# EAGLE design oled (EAGLE 7.5.0)
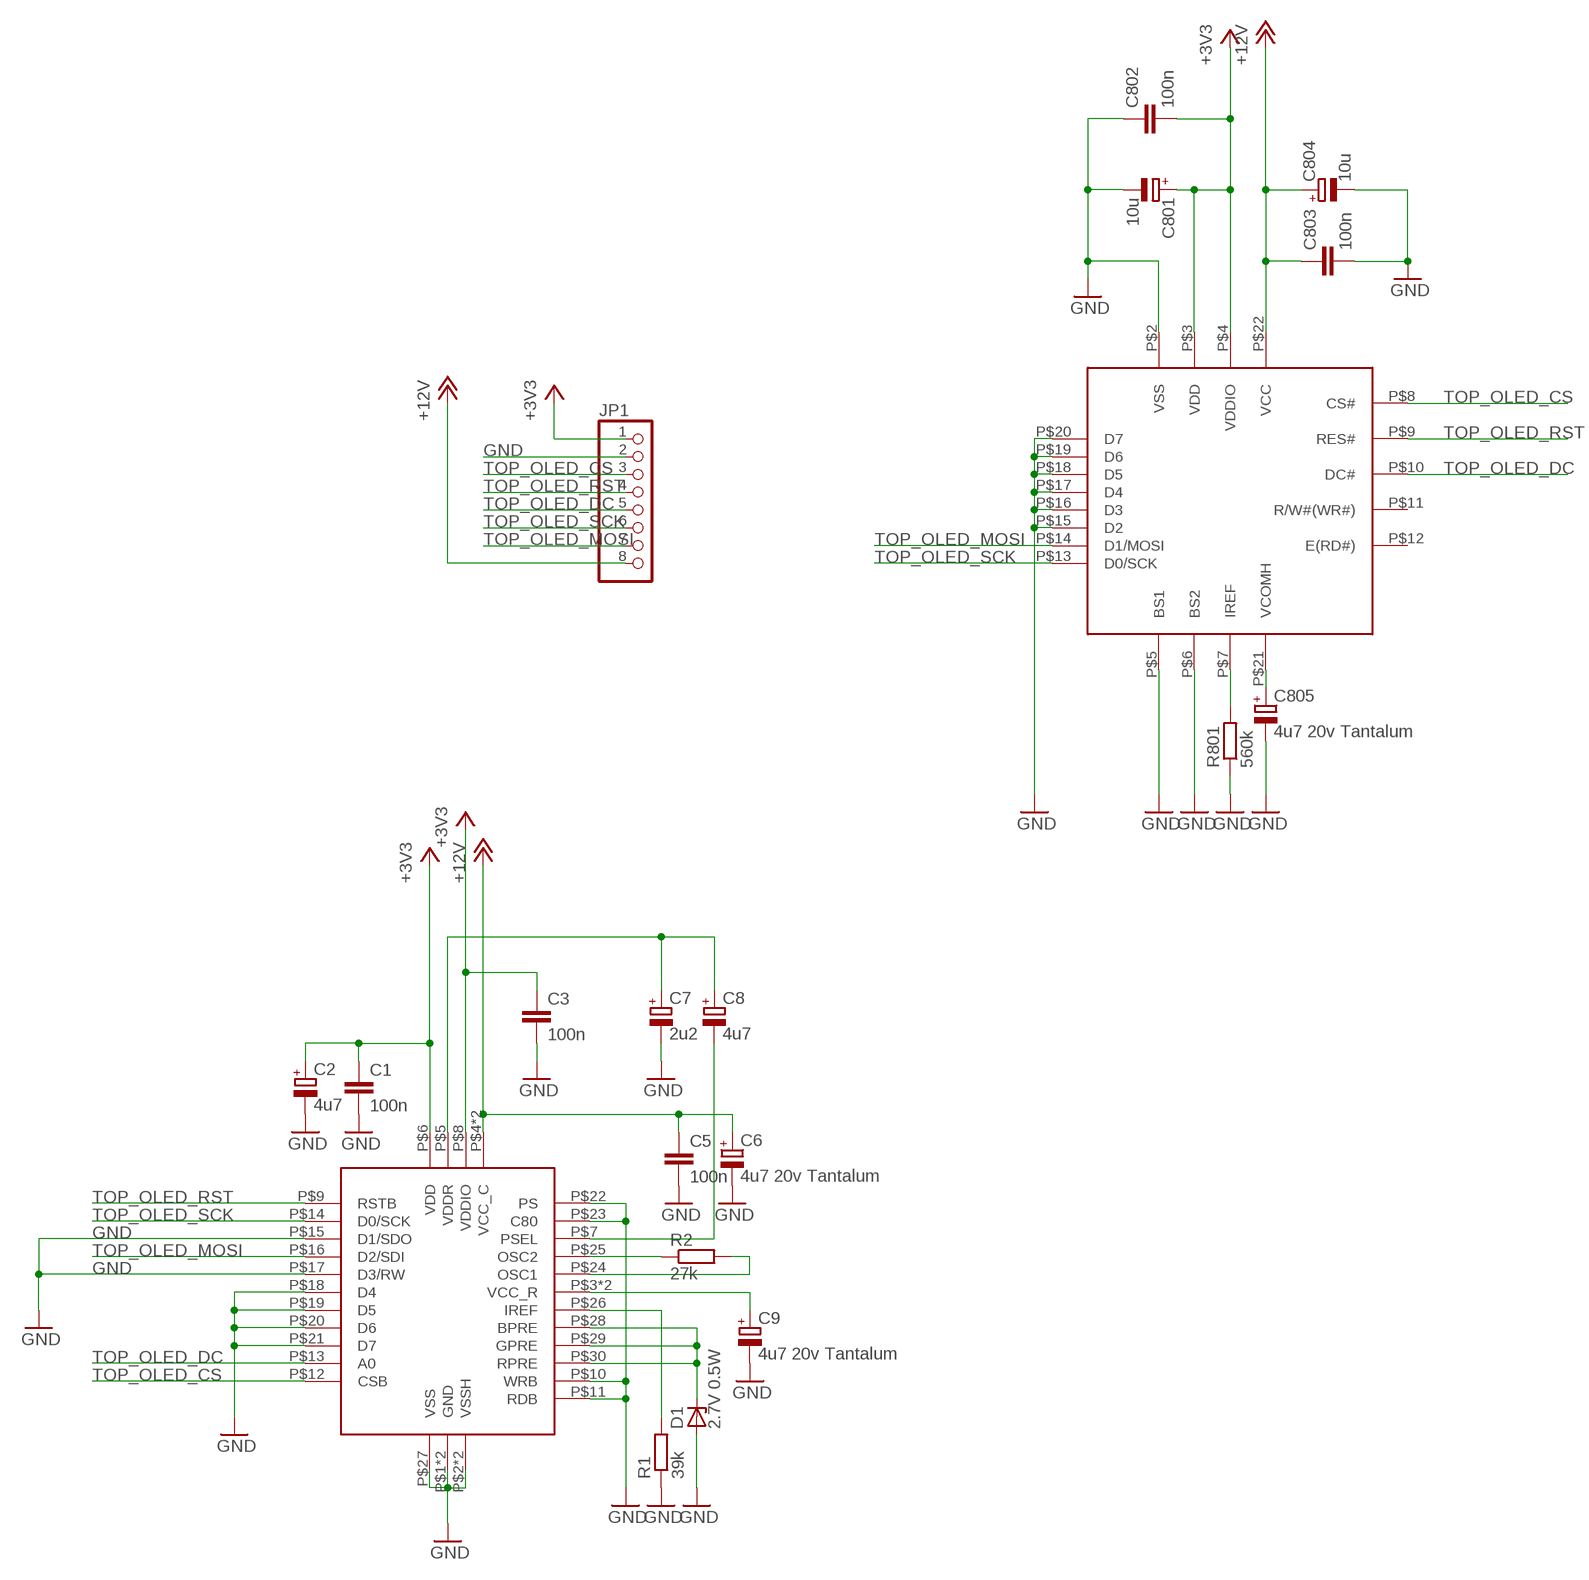
[diagram p0: schematic, sheet 1]

## Parts
C1  100n  C-EUC0603  [C0603]
C2  4u7  CPOL-EU153CLV-0505  [CPOL-5]
C3  100n  C-EUC0603  [C0603]
C5  100n  C-EUC0603  [C0603]
C6  4u7 20v Tantalum  CPOL-EUCT3216  [CT3216]
C7  2u2  CPOL-EU153CLV-0505  [CPOL-5]
C8  4u7  CPOL-EU153CLV-0505  [CPOL-5]
C9  4u7 20v Tantalum  CPOL-EUCT3216  [CT3216]
C801  10u  CPOL-EU153CLV-0505  [CPOL-5]
C802  100n  C-EUC0603  [C0603]
C803  100n  C-EUC0603  [C0603]
C804  10u  CPOL-EU153CLV-0505  [CPOL-5]
C805  4u7 20v Tantalum  CPOL-EUCT3216  [CT3216]
D1  2.7V 0.5W  ZENER-DIODESOD80C  [SOD80C]
JP1  PINHD-1X8  [1X08]
OLED  MCOT096064AZ-RGBM  [MCOT096064AZ-RGBM]
R1  39k  R-EU_0603  [0603]
R2  27k  R-EU_0603  [0603]
R801  560k  R-EU_0603  [0603]
U$1  MCOT096096AY  [MCOT096096AY]

## Nets
+3V3: C1.1 C2.+ C3.1 C801.+ C802.2 JP1.1 OLED.P$3(VDD) OLED.P$4(VDDIO) U$1.P$6(VDD) U$1.P$8(VDDIO)
+12V: C5.1 C6.+ C803.1 C804.+ JP1.8 OLED.P$22(VCC) U$1.P$4(VCC_C) U$1.P$31(VCC_C)
GND: C1.2 C2.- C3.2 C5.2 C6.- C7.- C9.- C801.- C802.1 C803.2 C804.- C805.- D1.A JP1.2 OLED.P$2(VSS) OLED.P$5(BS1) OLED.P$6(BS2) OLED.P$15(D2) OLED.P$16(D3) OLED.P$17(D4) OLED.P$18(D5) OLED.P$19(D6) OLED.P$20(D7) R1.1 R801.1 U$1.P$1(GND) U$1.P$2(VSSH) U$1.P$10(WRB) U$1.P$11(RDB) U$1.P$15(D1/SDO) U$1.P$17(D3/RW) U$1.P$18(D4) U$1.P$19(D5) U$1.P$20(D6) U$1.P$21(D7) U$1.P$22(PS) U$1.P$23(C80) U$1.P$27(VSS) U$1.P$33(VSSH) U$1.P$34(GND)
N$1: C9.+ U$1.P$3(VCC_R) U$1.P$32(VCC_R)
N$5: C7.+ C8.+ U$1.P$5(VDDR)
N$6: C805.+ OLED.P$21(VCOMH)
N$7: C8.- U$1.P$7(PSEL)
N$8: OLED.P$7(IREF) R801.2
N$9: D1.C U$1.P$28(BPRE) U$1.P$29(GPRE) U$1.P$30(RPRE)
N$10: R2.1 U$1.P$25(OSC2)
N$11: R2.2 U$1.P$24(OSC1)
N$12: R1.2 U$1.P$26(IREF)
TOP_OLED_CS: JP1.3 OLED.P$8(CS#) U$1.P$12(CSB)
TOP_OLED_DC: JP1.5 OLED.P$10(DC#) U$1.P$13(A0)
TOP_OLED_MOSI: JP1.7 OLED.P$14(D1/MOSI) U$1.P$16(D2/SDI)
TOP_OLED_RST: JP1.4 OLED.P$9(RES#) U$1.P$9(RSTB)
TOP_OLED_SCK: JP1.6 OLED.P$13(D0/SCK) U$1.P$14(D0/SCK)
Unconnected: OLED.P$11(R/W#(WR#)) OLED.P$12(E(RD#))

## Library data of the parts
C1 C3 C5 C802 C803 = Rebel:C-EU: CAPACITOR, European symbol
C2 C6-C9 C801 C804 C805 = Rebel:CPOL-EU: POLARIZED CAPACITOR, European symbol
D1 = diode:ZENER-DIODE: Z-Diode
JP1 = pinhead:PINHD-1X8: PIN HEADER
OLED = MCOT096064AZ-RGBM:MCOT096064AZ-RGBM: Midas 0.95in Red, Green, Blue Passive matrix OLED Display 96 x 64 TAB Multi Interface
R1 R2 R801 = Rebel:R-EU_: RESISTOR, European symbol
U$1 = Rebel:MCOT096096AY

## Net classes
1 power: width 0.178 mm, drill 0.305 mm, clearance 0.178 mm to class 0, clearance 0.178 mm

## Board
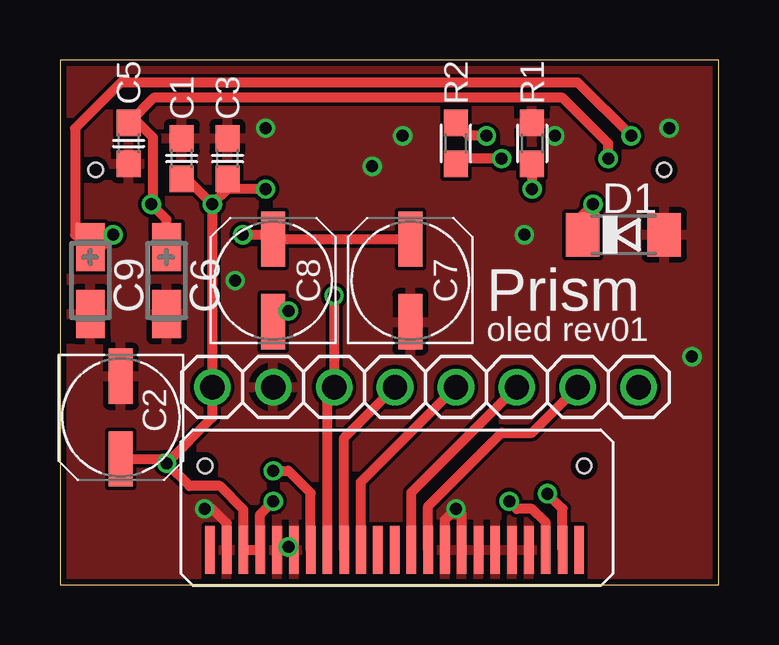
[diagram p1: board, top side]
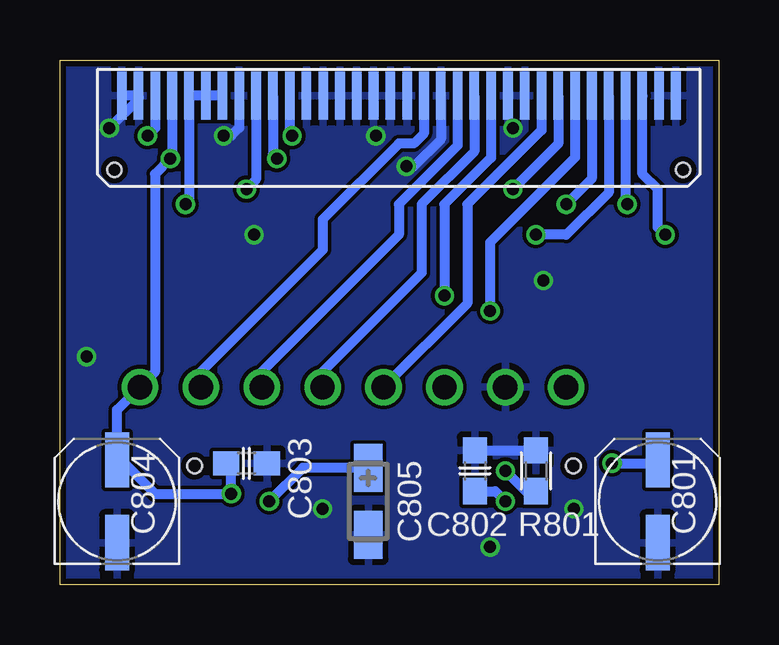
[diagram p2: board, bottom side, seen from below]

Size 27.46 x 21.89 mm. Coordinates in mm from the lower left corner, seen from the top.
Outline: 27.46,21.89 0,21.89 0,0 27.46,0 27.46,21.89
Copper layers (1*16): Top 0.035mm / dielectric 1.5mm / Bottom 0.035mm
Design rules "SeeedStudio_2layer_DRU_no_angle_20140221": minimum track width 6mil, minimum drill 12mil, track to track 6mil, track to pad 6mil, pad to pad 6mil, via to via 6mil, smd to smd 0mil, copper to edge 10mil, drill to drill 10mil, minimum pad ring 10mil, minimum via ring 6mil, stop-mask expansion 2mil, vias tented up to drill 100mil, thermal gap 10mil

### Footprints (pad centres in the part's own frame; a part is rotated, then mirrored left to right if it is on the bottom)
C0603 = smd 1.1 x 1: 1 -0.85,0; 2 0.85,0
CPOL-5 = smd 2.3 x 1: + 1.725,0; - -1.725,0
CT3216 = smd 2 x 1.2: + -1.4,0; - 1.4,0
SOD80C = smd 1.4 x 1.8: A 1.7,0; C -1.7,0
1X08 = drill 1.016: 1 -8.89,0; 2 -6.35,0; 3 -3.81,0; 4 -1.27,0; 5 1.27,0; 6 3.81,0; 7 6.35,0; 8 8.89,0
MCOT096064AZ-RGBM = smd 0.4 x 2: P$1 -7.72,-2.024; P$2 -7.02,-2.024; P$3 -6.32,-2.024; P$4 -5.62,-2.024; P$5 -4.92,-2.024; P$6 -4.22,-2.024; P$7 -3.52,-2.024; P$8 -2.82,-2.024; P$9 -2.12,-2.024; P$10 -1.42,-2.024; P$11 -0.72,-2.024; P$12 -0.02,-2.024; P$13 0.68,-2.024; P$14 1.38,-2.024; P$15 2.08,-2.024; P$16 2.78,-2.024; P$17 3.48,-2.024; P$18 4.18,-2.024; P$19 4.88,-2.024; P$20 5.58,-2.024; P$21 6.28,-2.024; P$22 6.98,-2.024; P$23 7.68,-2.024 | hole 0.6: -7.92,1.476; 7.88,1.476
0603 = smd 1.1 x 1: 1 -0.85,0; 2 0.85,0
MCOT096096AY = smd 0.4 x 2: P$1 -11.55,-2; P$2 -10.85,-2; P$3 -10.15,-2; P$4 -9.45,-2; P$5 -8.75,-2; P$6 -8.05,-2; P$7 -7.35,-2; P$8 -6.65,-2; P$9 -5.95,-2; P$10 -5.25,-2; P$11 -4.55,-2; P$12 -3.85,-2; P$13 -3.15,-2; P$14 -2.45,-2; P$15 -1.75,-2; P$16 -1.05,-2; P$17 -0.35,-2; P$18 0.35,-2; P$19 1.05,-2; P$20 1.75,-2; P$21 2.45,-2; P$22 3.15,-2; P$23 3.85,-2; P$24 4.55,-2; P$25 5.25,-2; P$26 5.95,-2; P$27 6.65,-2; P$28 7.35,-2; P$29 8.05,-2; P$30 8.75,-2; P$31 9.45,-2; P$32 10.15,-2; P$33 10.85,-2; P$34 11.55,-2 | hole 0.6: 11.85,1.1; -11.85,1.1

### Placement (x,y rotation side)
C1  5.08,17.78 90 top
C2  2.54,6.98 270 top
C3  6.99,17.78 90 top
C5  2.86,18.41 270 top
C6  4.45,12.7 270 top
C7  14.61,12.7 90 top
C8  8.89,12.7 90 top
C9  1.27,12.7 270 top
C801  2.54,3.49 90 bottom
C802  10.16,4.76 270 bottom
C803  19.68,5.08 0 bottom
C804  25.08,3.49 90 bottom
C805  14.61,3.49 270 bottom
D1  23.49,14.6 0 top
JP1  15.24,8.25 0 top
OLED  13.97,3.49 0 top
R1  19.68,18.41 270 top
R2  16.51,18.41 90 top
R801  7.62,4.76 270 bottom
U$1  13.34,18.41 180 bottom

### Tracks (layer width: path | path; a pad name or v marks a point on that pad's centre or on a via)
+3V3  (via drill 0.5)
  Top 0.406: v8.89,3.49 8.35,2.95 OLED.P$4 OLED.P$3 7.65,3.14 6.67,4.13 5.4,4.13 v4.45,5.08 | v6.35,15.88 JP1.1 6.35,6.98 v4.45,5.08 | v8.57,16.51 7.2,16.51 | 7.2,16.51 C3.1 | C1.1 5.29,16.93 v6.35,15.88 | 7.2,16.51 6.99,16.51 v6.35,15.88 | C2.+ 4.27,5.26 v4.45,5.08
  Bottom 0.406: C802.2 9.31,3.91 v8.89,3.49 | v4.45,5.08 2.72,5.08 C801.+ | U$1.P$6 5.29,16.94 v6.35,15.88 | U$1.P$8 6.69,18.4 v8.57,16.51
+12V  (via drill 0.5)
  Top 0.406: C6.+ 4.45,15.24 v3.81,15.88 3.88,15.95 3.88,18.66 3.28,19.27 C5.1 3.91,20.32 20.95,20.32 22.86,18.41 v22.86,17.78 | OLED.P$22 20.95,3.18 v20.32,3.81
  Bottom 0.406: U$1.P$4 3.88,15.8 v3.81,15.88 | U$1.P$31 22.79,17.85 v22.86,17.78 23.49,17.14 23.49,8.89 JP1.8 25.08,7.3 C804.+ 24.9,5.22 23.49,3.81 v20.32,3.81 20.32,4.86 C803.1
GND  (via drill 0.5)
  Top 0.406: 9.41,1.47 OLED.P$6 | OLED.P$2 6.95,2.58 6.35,3.17 v6.03,3.17 | OLED.P$5 9.41,1.47 | 9.41,1.47 v9.53,1.59 | OLED.P$15 16.05,2.71 v16.51,3.17 16.75,2.94 OLED.P$16
  Bottom 0.406: C802.1 R801.1 | U$1.P$34 U$1.P$33 24.18,20.27 v25.4,19.05 | U$1.P$27 19.98,19.07 20.32,18.73 v20.64,18.73 | U$1.P$15 11.59,18.58 12.7,17.46 v13.02,17.46
  other vias: 8.57,19.05 7.3,12.7 19.37,14.6 14.29,18.73 26.35,9.52
  pour Top: -5.71,23.49 34.93,23.49 34.93,-2.54 -5.71,-2.54
  pour Bottom: -3.17,22.22 -3.17,-1.27 32.39,-1.27 32.39,22.22
N$1  (via drill 0.5)
  Top 0.406: v2.22,14.6 1.72,14.1 C9.+ 0.64,14.6 0.64,19.05 2.54,20.95 21.59,20.95 v23.81,18.73
  Bottom 0.406: v2.22,14.6 2.54,14.92 2.54,16.51 3.17,17.14 U$1.P$3 | U$1.P$32 23.48,19.06 v23.81,18.73
N$5  (via drill 0.5)
  Top 0.406: v7.62,14.6 8.71,14.6 C8.+ C7.+
  Bottom 0.406: U$1.P$5 4.58,16.37 6.35,14.6 v7.62,14.6
N$6  (via drill 0.5)
  Top 0.406: OLED.P$21 20.25,2.61 19.68,3.17 19.05,3.17 v18.73,3.49
  Bottom 0.406: C805.+ 17.33,4.89 v18.73,3.49
N$7  (via drill 0.5)
  Top 0.406: v9.53,11.43 9.39,11.43 C8.-
  Bottom 0.406: U$1.P$7 5.99,17.83 9.53,14.29 v9.53,11.43
N$8  (via drill 0.5)
  Top 0.406: v8.89,4.76 9.53,4.76 10.45,3.84 OLED.P$7
  Bottom 0.406: R801.2 8.04,3.91 v8.89,4.76
N$9  (via drill 0.5)
  Top 0.406: D1.C 21.79,15.44 v22.22,15.88
  Bottom 0.406: v22.22,15.88 22.08,16.02 U$1.P$30 U$1.P$29 U$1.P$28
N$10  (via drill 0.5)
  Top 0.406: v18.41,17.78 16.72,17.78 R2.1
  Bottom 0.406: U$1.P$25 18.58,17.95 v18.41,17.78
N$11  (via drill 0.5)
  Top 0.406: v17.78,18.73 17.04,18.73 R2.2
  Bottom 0.406: U$1.P$24 17.88,18.84 v17.78,18.73
N$12  (via drill 0.5)
  Top 0.406: R1.2 v19.68,16.51
  Bottom 0.406: U$1.P$26 19.29,16.91 v19.68,16.51
TOP_OLED_CS  (via drill 0.5)
  Top 0.406: v11.43,12.06 JP1.3 11.15,7.97 OLED.P$8
  Bottom 0.406: U$1.P$12 9.48,17.82 11.43,15.88 v11.43,12.06
TOP_OLED_DC
  Top 0.406: OLED.P$10 12.55,4.3 JP1.5
  Bottom 0.406: U$1.P$13 10.19,18.07 12.38,15.88 12.38,13.02 16.51,8.89 JP1.5
TOP_OLED_MOSI
  Top 0.406: OLED.P$14 15.35,3.28 18.41,6.35 19.68,6.35 JP1.7
  Bottom 0.406: U$1.P$16 12.29,18.83 12.7,18.41 13.34,18.41 16.51,15.24 16.51,13.97 21.59,8.89 JP1.7
TOP_OLED_RST
  Top 0.406: OLED.P$9 11.85,6.13 JP1.4
  Bottom 0.406: U$1.P$9 7.38,18.97 10.48,15.88 10.48,11.75 JP1.4
TOP_OLED_SCK
  Top 0.406: OLED.P$13 14.65,3.85 JP1.6
  Bottom 0.406: U$1.P$14 10.88,18.33 13.34,15.88 13.34,14.6 19.05,8.89 JP1.6

### Text on the board
tPlace: Prism | oled rev01